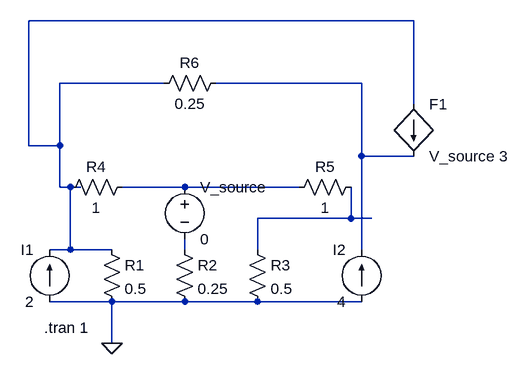
[diagram p0: schematic Ex_03_76.asc]
Ex_03_76.asc, the LTspice schematic file:
Version 4.1
SHEET 1 880 680
WIRE 544 -176 -48 -176
WIRE 160 -80 0 -80
WIRE 464 -80 240 -80
WIRE 544 -48 544 -176
WIRE -48 16 -48 -176
WIRE 0 16 0 -80
WIRE 0 16 -48 16
WIRE 464 32 464 -80
WIRE 544 32 464 32
WIRE 0 80 0 16
WIRE 16 80 0 80
WIRE 32 80 16 80
WIRE 192 80 96 80
WIRE 368 80 192 80
WIRE 448 128 448 80
WIRE 448 128 304 128
WIRE 480 128 448 128
WIRE 16 176 16 80
WIRE 16 176 -16 176
WIRE 80 176 16 176
WIRE 192 176 192 160
WIRE 304 176 304 128
WIRE 464 176 464 32
WIRE 80 256 -16 256
WIRE 192 256 80 256
WIRE 304 256 192 256
WIRE 464 256 304 256
WIRE 80 320 80 256
FLAG 80 320 0
SYMBOL current -16 256 R180
WINDOW 0 24 80 Left 2
WINDOW 3 24 0 Left 2
WINDOW 123 0 0 Left 0
WINDOW 39 0 0 Left 0
SYMATTR InstName I1
SYMATTR Value 2
SYMBOL current 464 256 R180
WINDOW 0 24 80 Left 2
WINDOW 3 24 0 Left 2
WINDOW 123 0 0 Left 0
WINDOW 39 0 0 Left 0
SYMATTR InstName I2
SYMATTR Value 4
SYMBOL res 64 160 R0
SYMATTR InstName R1
SYMATTR Value 0.5
SYMBOL res 176 160 R0
SYMATTR InstName R2
SYMATTR Value 0.25
SYMBOL res 288 160 R0
SYMATTR InstName R3
SYMATTR Value 0.5
SYMBOL voltage 192 64 R0
WINDOW 123 0 0 Left 0
WINDOW 39 0 0 Left 0
SYMATTR InstName V_source
SYMATTR Value 0
SYMBOL res 112 64 R90
WINDOW 0 0 56 VBottom 2
WINDOW 3 32 56 VTop 2
SYMATTR InstName R4
SYMATTR Value 1
SYMBOL res 464 64 R90
WINDOW 0 0 56 VBottom 2
WINDOW 3 32 56 VTop 2
SYMATTR InstName R5
SYMATTR Value 1
SYMBOL res 144 -64 R270
WINDOW 0 32 56 VTop 2
WINDOW 3 0 56 VBottom 2
SYMATTR InstName R6
SYMATTR Value 0.25
SYMBOL f 544 -48 R0
SYMATTR InstName F1
SYMATTR Value V_source 3
TEXT -24 296 Left 2 !.tran 1

The netlist it stands for:
* Ex_03_76.asc
I1 0 N001 2
I2 0 N002 4
R1 N001 0 0.5
R2 N005 0 0.25
R3 N004 0 0.5
V_source N003 N005 0
R4 N003 N001 1
R5 N004 N003 1
R6 N001 N002 0.25
F1 N001 N002 V_source 3
.tran 1
.backanno
.end